# Altium schematic sheet Esquematico Deck - Crazyflie.schdoc
size 214 x 93 mm
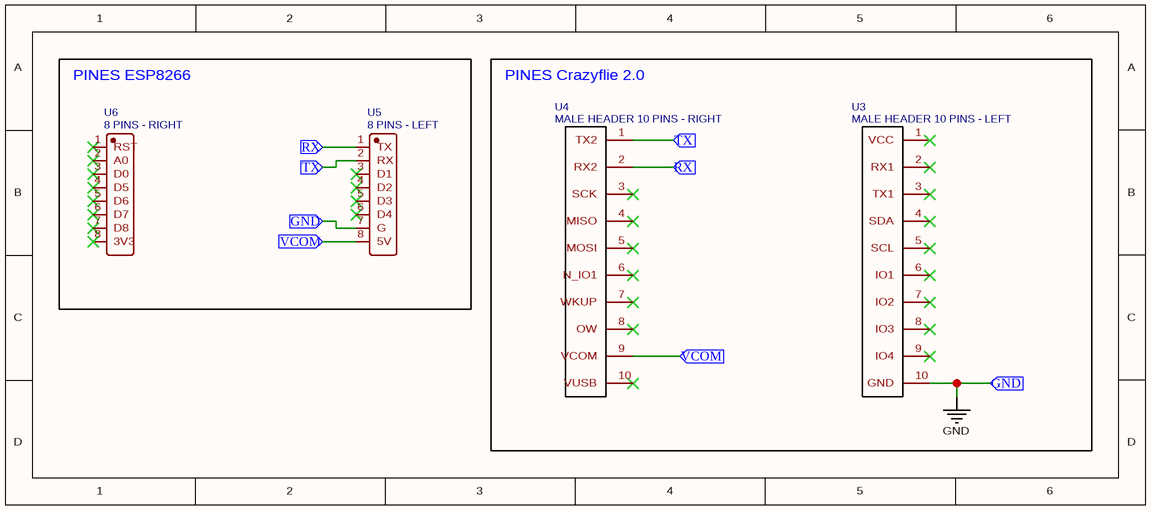
[diagram p0: Esquematico Deck - Crazyflie.schdoc]

## Parts
U3  MALE HEADER 10 PINS - LEFT  [MALE HEADER 10 PINS]
U4  MALE HEADER 10 PINS - RIGHT  [MALE HEADER 10 PINS]
U5  8 PINS - LEFT  [HDR-TH_8P-P2.54-V-F]
U6  8 PINS - RIGHT  [HDR-TH_8P-P2.54-V-F]

## Blocks framed on the sheet
PINES ESP8266: U5 U6
PINES Crazyflie 2.0: U3 U4

## Ports
GND (in), RX (in), TX (in), VCOM (in)

## Nets
GND: U3.10(GND) U5.7(G) ; port GND
RX: U4.2(RX2) U5.1(TX) ; port RX
TX: U4.1(TX2) U5.2(RX) ; port TX
VCOM: U4.9(VCOM) U5.8(5V) ; port VCOM

Not connected (* = marked no-connect by the designer): U3 1(VCC)* 2(RX1)* 3(TX1)* 4(SDA)* 5(SCL)* 6(IO1)* 7(IO2)* 8(IO3)* 9(IO4)*; U4 3(SCK)* 4(MISO)* 5(MOSI)* 6(N_IO1)* 7(WKUP)* 8(OW)* 10(VUSB)*; U5 3(D1)* 4(D2)* 5(D3)* 6(D4)*; U6 1(RST)* 2(A0)* 3(D0)* 4(D5)* 5(D6)* 6(D7)* 7(D8)* 8(3V3)*

## Library data of the parts
U3 = MALE HEADER 10 PINS - LEFT: Contributor: gor18062; spicePre: U; spiceSymbolName: MALE HEADER 10 PINS
U4 = MALE HEADER 10 PINS - RIGHT: Contributor: gor18062; spicePre: U; spiceSymbolName: MALE HEADER 10 PINS
U5 = 8 PINS - LEFT: BOM_Manufacturer: DEALON(德艺隆); BOM_Manufacturer Part: DM254R-11-08-85; Contributor: LCSC; BOM_Supplier: LCSC; BOM_Supplier Part: C2935979; spicePre: U; spiceSymbolName: DM254R-11-08-85
U6 = 8 PINS - RIGHT: BOM_Manufacturer: DEALON(德艺隆); BOM_Manufacturer Part: DM254R-11-08-85; Contributor: LCSC; BOM_Supplier: LCSC; BOM_Supplier Part: C2935979; spicePre: U; spiceSymbolName: DM254R-11-08-85